# Altium schematic sheet Overo Carrier.SchDoc: Overo Carrier
size B; ApprovedBy: D.Ankers; CheckedBy: D.Ankers; Author: J.Cotton; CompanyName: The OpenPilot Project; DrawnBy: J.Cotton; Engineer: J.Cotton; Organization: The OpenPilot Project; DocumentNumber: 1; Revision: 1; SheetNumber: 1; SheetTotal: 1; DocumentName: Overo Carrier
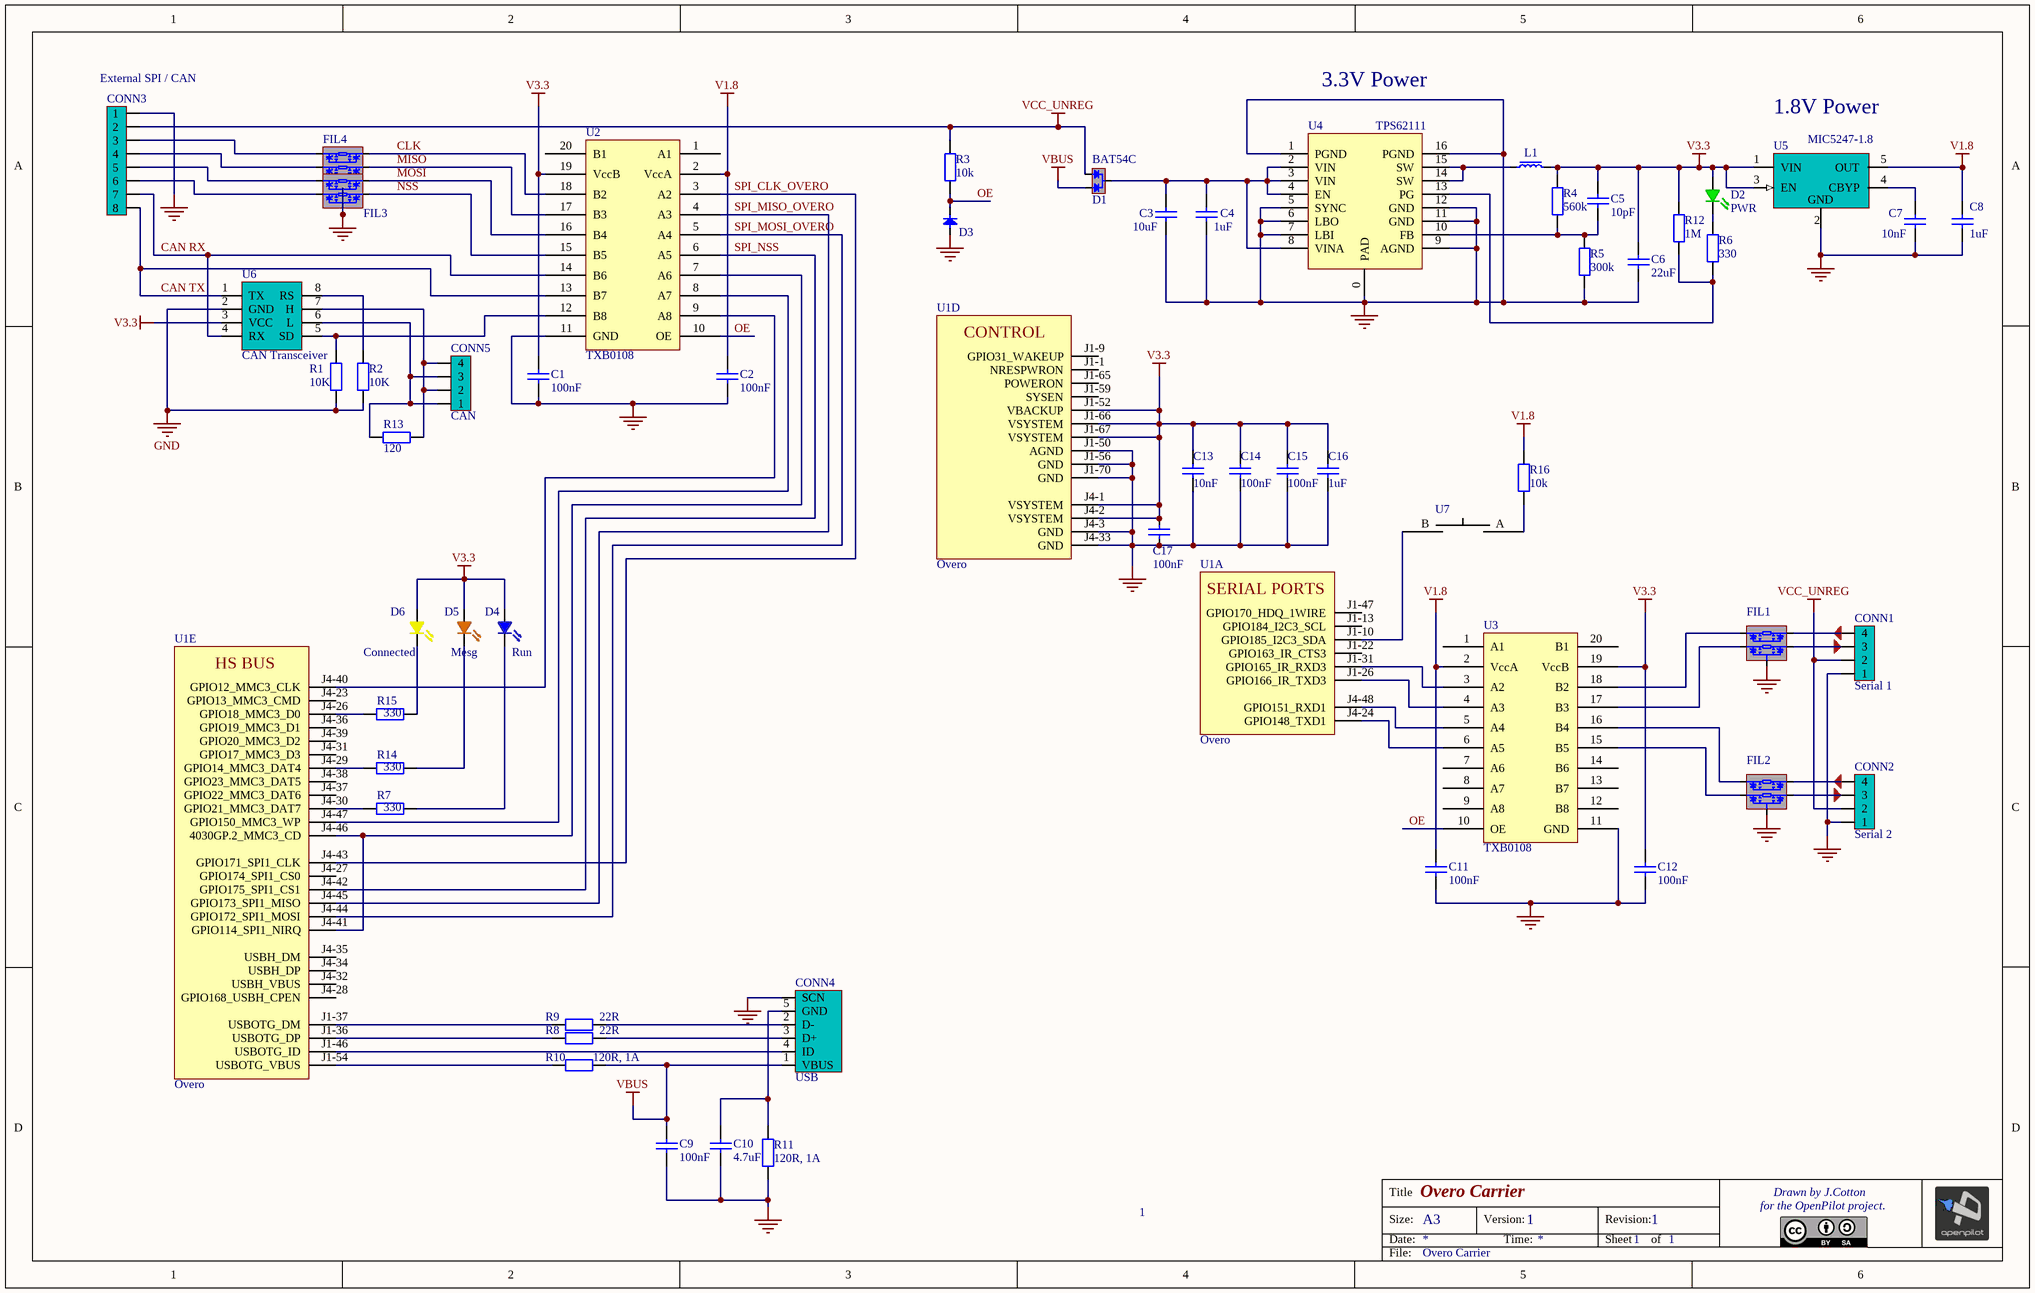
[diagram p0: Overo Carrier.SchDoc]

## Parts
C1  value 100nF  [CAP603N]  (hidden comment: Cap603)
C2  value 100nF  [CAP603N]  (hidden comment: Cap603)
C3  value 10uF  [CAP805N]  (hidden comment: Cap805)
C4  value 1uF  [CAP603L]  (hidden comment: Cap603)
C5  value 10pF  [CAP603N]  (hidden comment: Cap603)
C6  value 22uF  [CAP805N]  (hidden comment: Cap805)
C7  value 10nF  [CAP603N]  (hidden comment: Cap603)
C8  value 1uF  [CAP603L]  (hidden comment: Cap603)
C9  value 100nF  [CAP603N]  (hidden comment: Cap603)
C10  value 4.7uF  [CAP603L]  (hidden comment: Cap603)
C11  value 100nF  [CAP603N]  (hidden comment: Cap603)
C12  value 100nF  [CAP603N]  (hidden comment: Cap603)
C13  value 10nF  [CAP603N]  (hidden comment: Cap603)
C14  value 100nF  [CAP603N]  (hidden comment: Cap603)
C15  value 100nF  [CAP603N]  (hidden comment: Cap603)
C16  value 1uF  [CAP603L]  (hidden comment: Cap603)
C17  value 100nF  [CAP603N]  (hidden comment: Cap603)
CONN1  Serial 1  [JST SH 4 Pin Side Entry]
CONN2  Serial 2  [JST SH 4 Pin Side Entry]
CONN3  External SPI / CAN  [JST SH 8 Pin Side Entry]
CONN4  USB  [USB SMD]
CONN5  CAN  [JST SH 4 Pin Side Entry]
D1  BAT54C  [SOT23-3N]
D2  PWR  [LED603N]
D3  Diode Zen 3.3V 0603  [IND603N]  (value not drawn)
D4  Run  [LED603N]
D5  Mesg  [LED603N]
D6  Connected  [LED603N]
FIL1  IP4256CZ5-W,115  [SOT-665]  (value not drawn)
FIL2  IP4256CZ5-W,115  [SOT-665]  (value not drawn)
FIL3  IP4256CZ5-W,115  [SOT-665]  (value not drawn)
FIL4  IP4256CZ5-W,115  [SOT-665]  (value not drawn)
L1  FB 550mA 6.8µH 0805  [IND805L]  (value not drawn)
R1  value 10K  [RES603N]  (hidden comment: Res603)
R2  value 10K  [RES603N]  (hidden comment: Res603)
R3  value 10k  [RES603N]  (hidden comment: Res603)
R4  value 560k  [RES603N]  (hidden comment: Res603)
R5  value 300k  [RES603N]  (hidden comment: Res603)
R6  value 330  [RES603N]  (hidden comment: Res603)
R7  value 330  [RES603N]  (hidden comment: Res603)
R8  value 22R  [RES603N]  (hidden comment: Res603)
R9  value 22R  [RES603N]  (hidden comment: Res603)
R10  value 120R, 1A  [RES805L]  (hidden comment: Res805)
R11  value 120R, 1A  [RES805L]  (hidden comment: Res805)
R12  value 1M  [RES603N]  (hidden comment: Res603)
R13  value 120  [RES603N]  (hidden comment: Res603)
R14  value 330  [RES603N]  (hidden comment: Res603)
R15  value 330  [RES603N]  (hidden comment: Res603)
R16  value 10k  [RES603N]  (hidden comment: Res603)
U1  Overo  [OVERO]  (parts A,D,E of 7)
U2  TXB0108  [SOP65P640X162-20N]
U3  TXB0108  [SOP65P640X162-20N]
U4  TPS62111  [QFN65P400X400X100-16N]
U5  MIC5247-1.8  [SOT23-5L]
U6  CAN Transceiver  [SOT23-8]
U7  Switch push Button  [EVQ-Q2K03W]  (value not drawn)

## Nets
GND: C1.1 C2.1 C3.1 C4.1 C6.1 C7.1 C8.1 C9.1 C10.1 C11.1 C12.1 C13.1 C14.1 C15.2 C16.1 C17.1 CONN1.1 CONN2.1 CONN3.1 CONN4.0(SCN) D3.2(A) FIL1.2(PAD) FIL2.2(PAD) FIL3.2(PAD) FIL4.2(PAD) R1.1 R2.1 R5.1 R11.2 U1.J1-50(AGND) U1.J1-56(GND) U1.J1-70(GND) U1.J4-3(GND) U1.J4-33(GND) U2.11(GND) U3.11(GND) U4.0(PAD) U4.1(PGND) U4.5(SYNC) U4.6(LBO) U4.7(LBI) U4.9(AGND) U4.11(GND) U4.12(GND) U4.16(PGND) U5.2(GND) U6.2(GND)
V1.8: C2.2 C8.2 C11.2 R16.1 U2.2(VccA) U3.2(VccA) U5.5(OUT)
V3.3: C1.2 C5.2 C6.2 C12.2 C13.2 C14.2 C15.1 C16.2 C17.2 D2.2(A) D4.2(A) D5.2(A) D6.2(A) L1.2 R4.2 R12.1 U1.J1-52(VBACKUP) U1.J1-66(VSYSTEM) U1.J1-67(VSYSTEM) U1.J4-1(VSYSTEM) U1.J4-2(VSYSTEM) U2.19(VccB) U3.19(VccB) U5.1(VIN) U5.3(EN) U6.3(VCC)
VBUS: C9.2 CONN4.1(VBUS) D1.2(A2) R10.1
VCC_UNREG: CONN1.2 CONN2.2 CONN3.2 D1.1(A1) R3.1
CAN RX: CONN3.7 U2.14(B6) U6.4(RX)
CAN TX: CONN3.8 U2.13(B7) U6.1(TX)
CLK: FIL4.3 U2.18(B2)
MISO: FIL4.1 U2.17(B3)
MOSI: FIL3.3 U2.16(B4)
NSS: FIL3.1 U2.15(B5)
OE: D3.1(K) R3.2 U2.10(OE) U3.10(OE)
SPI_CLK_OVERO: U1.J4-43(GPIO171_SPI1_CLK) U2.3(A2)
SPI_MISO_OVERO: U1.J4-45(GPIO173_SPI1_MISO) U2.4(A3)
SPI_MOSI_OVERO: U1.J4-44(GPIO172_SPI1_MOSI) U2.5(A4)
SPI_NSS: U1.J4-42(GPIO175_SPI1_CS1) U2.6(A5)
NetC3_2: C3.2 C4.2 D1.3(COM) U4.2(VIN) U4.3(VIN) U4.4(EN) U4.8(VINA)
NetC5_1: C5.1 R4.1 R5.2 U4.10(FB)
NetC7_2: C7.2 U5.4(CBYP)
NetC10_2: C10.2 CONN4.5(GND) R11.1
NetCONN1_3: CONN1.3 FIL1.4
NetCONN1_4: CONN1.4 FIL1.5
NetCONN2_3: CONN2.3 FIL2.4
NetCONN2_4: CONN2.4 FIL2.5
NetCONN3_3: CONN3.3 FIL4.4
NetCONN3_4: CONN3.4 FIL4.5
NetCONN3_5: CONN3.5 FIL3.4
NetCONN3_6: CONN3.6 FIL3.5
NetCONN4_2: CONN4.2(D-) R9.1
NetCONN4_3: CONN4.3(D+) R8.1
NetCONN4_4: CONN4.4(ID) U1.J1-46(USBOTG_ID)
NetCONN5_1: CONN5.1 CONN5.3 R13.1 U6.6(L)
NetCONN5_2: CONN5.2 CONN5.4 R13.2 U6.7(H)
NetD2_1: D2.1(K) R6.2
NetD4_1: D4.1(K) R7.2
NetD5_1: D5.1(K) R14.1
NetD6_1: D6.1(K) R15.1
NetFIL1_1: FIL1.1 U3.18(B2)
NetFIL1_3: FIL1.3 U3.17(B3)
NetFIL2_1: FIL2.1 U3.16(B4)
NetFIL2_3: FIL2.3 U3.15(B5)
NetL1_1: L1.1 U4.14(SW) U4.15(SW)
NetR1_2: R1.2 U2.12(B8) U6.5(SD)
NetR2_2: R2.2 U6.8(RS)
NetR6_1: R6.1 R12.2 U4.13(PG)
NetR7_1: R7.1 U1.J4-30(GPIO21_MMC3_DAT7)
NetR8_2: R8.2 U1.J1-36(USBOTG_DP)
NetR9_2: R9.2 U1.J1-37(USBOTG_DM)
NetR10_2: R10.2 U1.J1-54(USBOTG_VBUS)
NetR14_2: R14.2 U1.J4-29(GPIO14_MMC3_DAT4)
NetR15_2: R15.2 U1.J4-26(GPIO18_MMC3_D0)
NetR16_2: R16.2 U7.A
NetU1_J1-10: U1.J1-10(GPIO185_I2C3_SDA) U7.B
NetU1_J1-26: U1.J1-26(GPIO166_IR_TXD3) U3.4(A3)
NetU1_J1-31: U1.J1-31(GPIO165_IR_RXD3) U3.3(A2)
NetU1_J4-24: U1.J4-24(GPIO148_TXD1) U3.6(A5)
NetU1_J4-40: U1.J4-40(GPIO12_MMC3_CLK) U2.9(A8)
NetU1_J4-41: U1.J4-41(GPIO114_SPI1_NIRQ) U1.J4-46(4030GP.2_MMC3_CD) U2.7(A6)
NetU1_J4-47: U1.J4-47(GPIO150_MMC3_WP) U2.8(A7)
NetU1_J4-48: U1.J4-48(GPIO151_RXD1) U3.5(A4)

Not connected (* = marked no-connect by the designer): U1 J1-1(NRESPWRON) J1-9(GPIO31_WAKEUP) J1-13(GPIO184_I2C3_SCL) J1-22(GPIO163_IR_CTS3) J1-47(GPIO170_HDQ_1WIRE) J1-59(SYSEN) J1-65(POWERON) J4-23(GPIO13_MMC3_CMD) J4-27(GPIO174_SPI1_CS0) J4-28(GPIO168_USBH_CPEN) J4-31(GPIO17_MMC3_D3) J4-32(USBH_VBUS) J4-34(USBH_DP) J4-35(USBH_DM) J4-36(GPIO19_MMC3_D1) J4-37(GPIO22_MMC3_DAT6) J4-38(GPIO23_MMC3_DAT5) J4-39(GPIO20_MMC3_D2); U2 1(A1) 20(B1); U3 1(A1) 7(A6) 8(A7) 9(A8) 12(B8) 13(B7) 14(B6) 20(B1)

## Notes on the sheet
- 3.3V Power
- (near U5) 1.8V Power
- 1
- Title
- Size:
- Date:
- A3
- Version:
- Time:
- Revision:
- Sheet
- of
- for the OpenPilot project.
- Drawn by J.Cotton
- File:
- (in symbol Overo, part A) SERIAL PORTS
- (in symbol Overo, part D) CONTROL
- (in symbol Overo, part E) HS BUS

## Library data of the parts
C1 C2 C4 C5 C7-C17 = Cap603: Capacitor SMD; Published: 1-Nov-2010; LatestRevisionDate: 1-Nov-2010; LatestRevisionNote: Released OpenPilot Lib; PackageReference: 0603 (1608 Metric); Publisher: The OpenPilot Project; Supplier 1: Digi-Key
  C1 C2 C9 C11 C12 C14 C15 C17: Supplier Part Number 1: 399-5089-1-ND
  C4 C8 C16: Supplier Part Number 1: 445-5172-1-ND
  C5: ComponentLink2Description: Datasheet; Supplier Part Number 1: 399-1049-1-ND
  C7 C13: Supplier Part Number 1: 399-1091-1-ND
  C10: Supplier Part Number 1: 445-5178-1-ND
C3 C6 = Cap805: Capacitor SMD; Published: 1-Nov-2010; LatestRevisionDate: 1-Nov-2010; LatestRevisionNote: Released OpenPilot Lib; PackageReference: 0805 (2012 Metric); Publisher: The OpenPilot Project; Supplier 1: Digi-Key
  C3: Supplier Part Number 1: 490-3886-1-ND
  C6: ComponentLink2Description: Datasheet; Supplier Part Number 1: 587-1305-1-ND
CONN1 CONN2 CONN5 = JST-SH 4-pin Side Entry Socket: Manufacturer: Generic Components; Class: Connector; Supplier 1: Digi-Key; Supplier Part Number 1: 455-1804-1-ND
CONN3 = JST-SH 8-pin Side Entry Socket: Manufacturer: Generic Components; Class: Connector; Supplier 1: Digi-Key; Supplier Part Number 1: 455-1808-1-ND; ComponentLink2Description: Datasheet; LatestRevisionDate: 1-Nov-2010; LatestRevisionNote: Released OpenPilot Lib; Published: 1-Nov-2010; Publisher: The OpenPilot Project
CONN4 = USB_SMT_B: USB Type-B SMT Socket; Class: Connector; Supplier 1: Digi-Key; Supplier Part Number 1: WM17148CT-ND
D1 = BAT54C: Dual Diode Command Cathode; Manufacturer: STMicroelectronics; Manufacturer Part Number: BAT54CFILM; Description: DIODE SCHOTTKY SS 40V 0.3A SOT23; Voltage - Forward (Vf) (Max) @ If: 900mV @ 100mA; Current - Reverse Leakage @ Vr: 1µA @ 30V; Current - Average Rectified (Io) (per Diode): 300mA (DC); Voltage - DC Reverse (Vr) (Max): 40V; Reverse Recovery Time (trr): 5ns; Diode Type: Schottky; Speed: Fast Recovery =< 500ns, > 200mA (Io); Diode Configuration: 1 Pair Common Cathode; Supplier 1: Digi-Key; Supplier Part Number 1: 497-3786-1-ND; RoHS: RoHS Compliant; Category: Discrete Semiconductor Products; Stock 1: 17096; Pricing 1: 1=0.53, 10=0.38, 100=0.228, 250=0.16152, 500=0.1292, 1000=0.0988 (USD); Mounting Type: Surface Mount; Package / Case: TO-236-3, SC-59, SOT-23-3; Supplier Device Package: SOT-23-3; Packaging: Cut Tape (CT); ComponentLink1URL: http://www.st.com/internet/com/TECHNICAL_RESOURCES/TECHNICAL_LITERATURE/DATASHEET/CD00001322.pdf; ComponentLink1Description: http://www.st.com/internet/com/TECHNICAL_RESOURCES/TECHNICAL_LITERATURE/DATASHEET/CD00001322.pdf
D2 = LED 603 Gr: Green 603 LED; Value: 2.1v 20mA; Supplier 1: Digi-Key; Supplier Part Number 1: 754-1116-1-ND
D3 = Diode Zener 3.3V 150MW 0603: RoHS: RoHS Compliant; Diode Type: Zener; Mounting Type: Surface Mount; Packaging: Cut Tape (CT); ComponentLink1URL: http://www.diodes.com/datasheets/bat54srs.pdf; Supplier 1: Digi-Key; Supplier Part Number 1: 641-1024-1-ND
D4 = LED 603 Bl: Blue 603 LED; Value: 2.1v 20mA; Supplier 1: Digi-Key; Supplier Part Number 1: 350-2037-1-ND
D5 = LED 603 Or: Orange 603 LED; Value: 2.1v 20mA; Supplier 1: Digi-Key; Supplier Part Number 1: 754-1120-1-ND; ComponentLink2Description: Datasheet; LatestRevisionDate: 1-Nov-2010; LatestRevisionNote: Released OpenPilot Lib; Published: 1-Nov-2010; Publisher: The OpenPilot Project
D6 = LED 603 Yellow: Yellow 603 LED; Value: 2.1v 20mA; ComponentLink2Description: Datasheet; LatestRevisionDate: 1-Nov-2010; LatestRevisionNote: Released OpenPilot Lib; Published: 1-Nov-2010; Publisher: The OpenPilot Project; Supplier 1: Digi-Key; Supplier Part Number 1: 754-1125-1-ND
FIL1-FIL4 = RF Filter 100R 30pF: IP4256CZ5-W,115 2 channel, 100R, 30pF, RF ESD Filter; Manufacturer: Generic Components; Class: Passive; Supplier 1: Digi-Key; Supplier Part Number 1: 568-5871-1-ND; ComponentLink2Description: Datasheet; LatestRevisionDate: 1-Nov-2010; LatestRevisionNote: Released OpenPilot Lib; Published: 1-Nov-2010; Publisher: The OpenPilot Project
L1 = Ferrite Bead 550mA 6.8µH 0805: Ferrite Bead 550mA 6.8µH; Manufacturer: Generic Components; Class: Passive; ComponentLink2Description: Datasheet; LatestRevisionDate: 1-Nov-2010; LatestRevisionNote: Released OpenPilot Lib; Published: 1-Nov-2010; Publisher: The OpenPilot Project; Supplier 1: Digi-Key; Supplier Part Number 1: 445-6761-1-ND
R1-R9 R12-R16 = Res603: Resistor SMD; Published: 1-Nov-2010; LatestRevisionDate: 1-Nov-2010; LatestRevisionNote: Released OpenPilot Lib; Publisher: The OpenPilot Project; Supplier 1: Digi-Key
  R1-R3 R16: PackageReference: 0603 (1608 Metric); ComponentLink2Description: Datasheet; Supplier Part Number 1: P10.0KHCT-ND
  R4: PackageReference: 0603 (1608 Metric); ComponentLink2Description: Datasheet; Supplier Part Number 1: P560KHCT-ND
  R5: PackageReference: 0603 (1608 Metric); ComponentLink2Description: Datasheet; Supplier Part Number 1: P300KHCT-ND
  R6 R7 R14 R15: PackageReference: 0603 (1608 Metric); ComponentLink2Description: Datasheet; Supplier Part Number 1: RHM330HCT-ND
  R8 R9: PackageReference: 0402 (1005 Metric); Supplier Part Number 1: P22GCT-ND
  R12: PackageReference: 0603 (1608 Metric); ComponentLink2Description: Datasheet; Supplier Part Number 1: P1.0MGCT-ND
  R13: PackageReference: 0603 (1608 Metric); ComponentLink2Description: Datasheet; Supplier Part Number 1: P120HCT-ND
R10 R11 = Res805: Resistor SMD; Published: 1-Nov-2010; LatestRevisionDate: 1-Nov-2010; LatestRevisionNote: Released OpenPilot Lib; PackageReference: 0805 (2012 Metric); Publisher: The OpenPilot Project; ComponentLink2Description: Datasheet; Supplier 1: Digi-Key; Supplier Part Number 1: RHM120KCT-ND
U1 = Overo: Gumstix Overo COM
U2 U3 = TXB0108PW: Bidirection level shifter; Supplier 1: Digi-Key; Supplier Part Number 1: 296-21527-1-ND
U4 = TPS62111: Step-Down Buck 3.3V; Supplier 1: Digi-Key; Supplier Part Number 1: 296-20670-1-ND
U5 = MIC5247-1.8: 1.8V 150mA LDO Regulator A Grade; ComponentLink2Description: Datasheet; LatestRevisionDate: 1-Nov-2010; LatestRevisionNote: Released OpenPilot Lib; Published: 1-Nov-2010; Publisher: The OpenPilot Project; Supplier 1: Digi-Key; Supplier Part Number 1: 576-1288-1-ND
U6 = CAN MAX3051: CAN Transceiver MAX3051; ComponentLink2Description: Datasheet; LatestRevisionDate: 1-Nov-2010; LatestRevisionNote: Released OpenPilot Lib; Published: 1-Nov-2010; Publisher: The OpenPilot Project; Supplier 1: Digi-Key; Supplier Part Number 1: MAX3051EKA+TCT-ND
U7 = Push Switch: Switch; Supplier 1: Digi-Key; Supplier Part Number 1: P12943SCT-ND